# EAGLE design M2 (EAGLE 7.7.0)
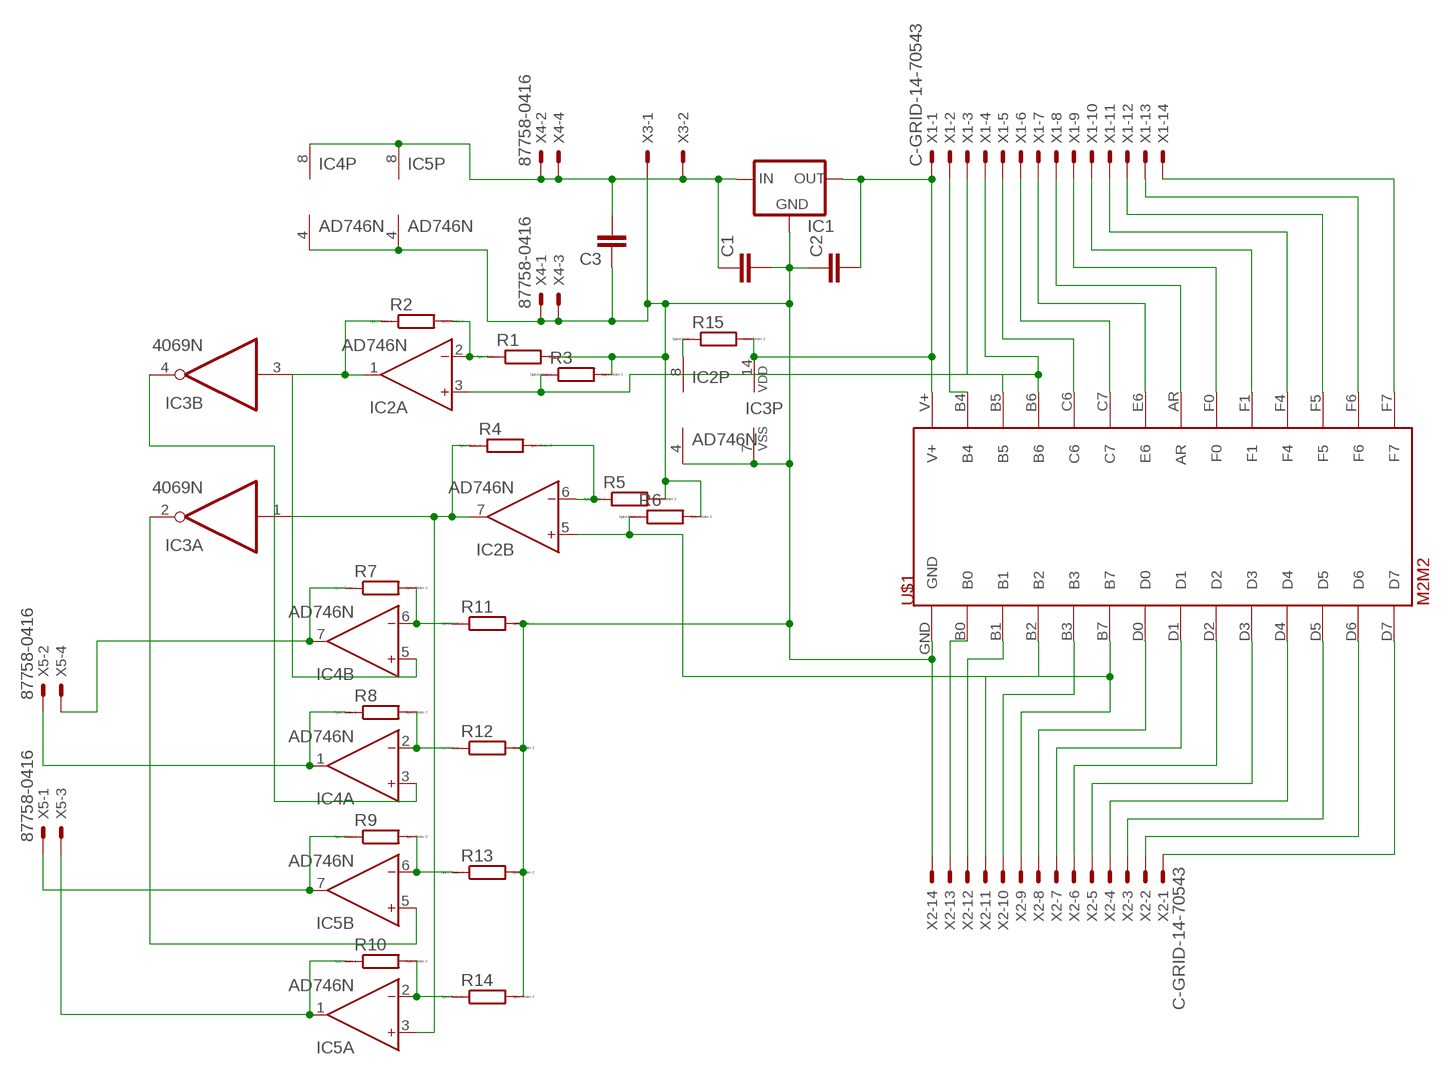
[diagram p0: schematic, sheet 1]

## Parts
C1  C2,5-3  [C2.5-3]
C2  C2,5-3  [C2.5-3]
C3  C2,5-3  [C2.5-3]
IC1  78MXXS  [78MXXS]
IC2  AD746N  [DIL08]
IC3  4069N  [DIL14]
IC4  AD746N  [DIL08]
IC5  AD746N  [DIL08]
R1  R0204/7  [0204/7]
R2  R0204/7  [0204/7]
R3  R0204/7  [0204/7]
R4  R0204/7  [0204/7]
R5  R0204/7  [0204/7]
R6  R0204/7  [0204/7]
R7  R0204/7  [0204/7]
R8  R0204/7  [0204/7]
R9  R0204/7  [0204/7]
R10  R0204/7  [0204/7]
R11  R0204/7  [0204/7]
R12  R0204/7  [0204/7]
R13  R0204/7  [0204/7]
R14  R0204/7  [0204/7]
R15  R0204/7  [0204/7]
U$1  M2M2  [M2]
X1  C-GRID-14-70543  [70543-14]
X2  C-GRID-14-70543  [70543-14]
X3  KK-156-2  [KK-156-2]
X4  87758-0416  [87758-0416]
X5  87758-0416  [87758-0416]

## Nets
N$1: C2.2 IC1.OUT IC3.14(P:VDD) R15.2 U$1.V+ X1.1
N$2: U$1.B4 X1.2
N$3: U$1.B5 X1.3
N$4: IC2.3(A:IN+) R3.1 U$1.B6 X1.4
N$5: U$1.C6 X1.5
N$6: U$1.C7 X1.6
N$7: U$1.E6 X1.7
N$8: U$1.AR X1.8
N$9: U$1.F0 X1.9
N$10: U$1.F1 X1.10
N$11: U$1.F4 X1.11
N$12: U$1.F5 X1.12
N$13: U$1.F6 X1.13
N$14: IC2.8(P:V+) R15.1
N$15: U$1.F7 X1.14
N$16: IC2.1(A:OUT) IC3.3(B:I) IC4.5(B:IN+) R2.1
N$17: U$1.B0 X2.13
N$18: U$1.B1 X2.12
N$19: U$1.B2 X2.11
N$20: U$1.B3 X2.10
N$21: IC2.5(B:IN+) R6.1 U$1.B7 X2.9
N$22: U$1.D0 X2.8
N$23: U$1.D1 X2.7
N$24: U$1.D2 X2.6
N$25: U$1.D3 X2.5
N$26: U$1.D4 X2.4
N$27: U$1.D5 X2.3
N$28: U$1.D6 X2.2
N$29: U$1.D7 X2.1
N$31: IC2.2(A:IN-) R1.1 R2.2
N$32: IC2.6(B:IN-) R4.2 R5.1
N$33: IC2.7(B:OUT) IC3.1(A:I) IC5.3(A:IN+) R4.1
N$34: C1.1 C3.2 IC1.IN IC4.8(P:V+) IC5.8(P:V+) X3.2 X4.2 X4.4
N$35: C1.2 C2.1 C3.1 IC1.GND IC2.4(P:V-) IC3.7(P:VSS) IC4.4(P:V-) IC5.4(P:V-) R1.2 R3.2 R5.2 R6.2 R11.2 R12.2 R13.2 R14.2 U$1.GND X2.14 X3.1 X4.1 X4.3
N$36: IC4.7(B:OUT) R7.1 X5.4
N$37: IC4.1(A:OUT) R8.1 X5.2
N$38: IC5.7(B:OUT) R9.1 X5.1
N$39: IC5.1(A:OUT) R10.1 X5.3
N$40: IC4.6(B:IN-) R7.2 R11.1
N$41: IC4.2(A:IN-) R8.2 R12.1
N$42: IC5.6(B:IN-) R9.2 R13.1
N$43: IC5.2(A:IN-) R10.2 R14.1
N$44: IC3.2(A:O) IC5.5(B:IN+)
N$45: IC3.4(B:O) IC4.3(A:IN+)
Unconnected: IC3.5(C:I) IC3.6(C:O) IC3.8(D:O) IC3.9(D:I) IC3.10(E:O) IC3.11(E:I) IC3.12(F:O) IC3.13(F:I)

## Library data of the parts
C1-C3 = capacitor-wima:C: CAPACITOR naming: grid - package width
IC1 = v-reg:78MXXS: VOLTAGE REGULATOR
IC2 IC4 IC5 = analog-devices:AD746: Dual Precision, 500 ns Settling, BiFET Op Amp Source: http://www.analog.com/static/imported-files/data_sheets/AD746.pdf; MF: ALTERA CORPORATION; MPN: AD746JNZ; OC_FARNELL: 1438363; OC_NEWARK: 59K4844
IC3 = 40xx:4069: Hex INVERTER
R1-R15 = eagle-ltspice:R: RESISTOR, European symbol; SPICEMODEL: NONE; SPICEPREFIX: R
U$1 = m2:M2
X1 X2 = con-molex:C-GRID-14: CONNECTOR wire to board 2.54 mm (0.100") pitch header; OC_FARNELL: unknown; OC_NEWARK: unknown
X3 = con-molex:KK-156-2: KK 156 HEADER Source: http://www.molex.com/pdm_docs/sd/026604100_sd.pdf; OC_FARNELL: unknown; OC_NEWARK: unknown
X4 X5 = con-molex:87758-0416: 4 Pin - 2mm Dual Row Single Wafer, Vertical T/H HDR Source: http://www.molex.com/pdm_docs/sd/877580616_sd.pdf; MF: FARNELL; MPN: 87758-0416; OC_FARNELL: 7472315; OC_NEWARK: 39K3681

## Board
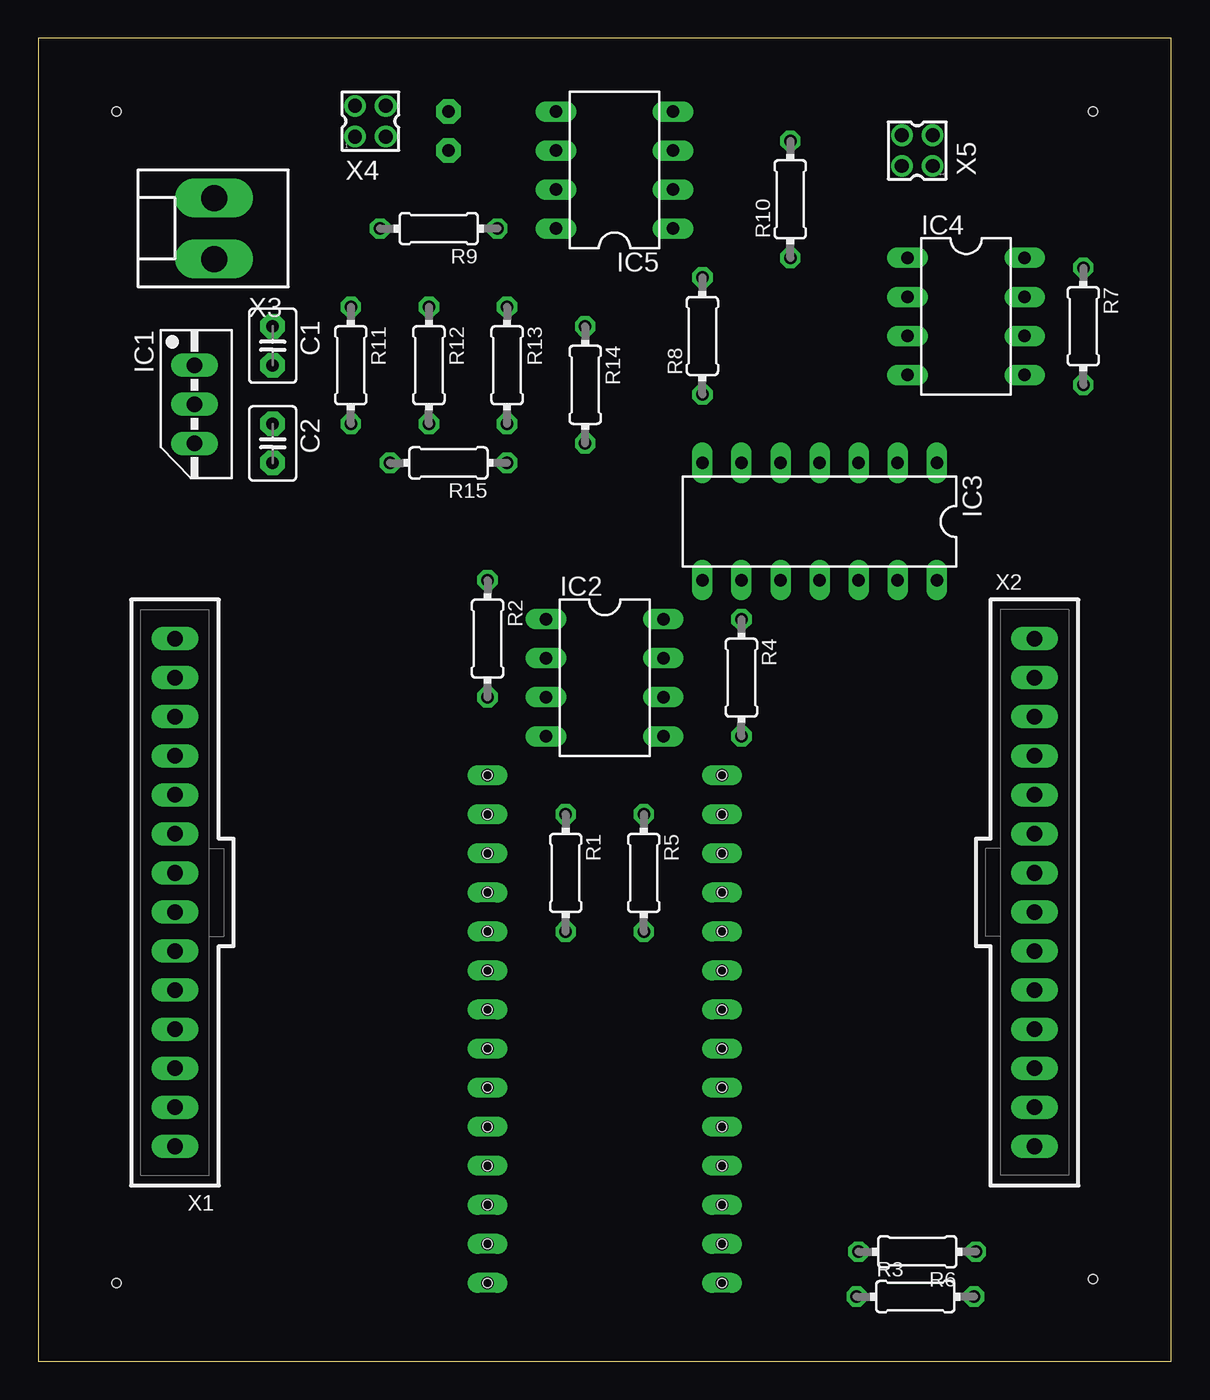
[diagram p1: board, top side]
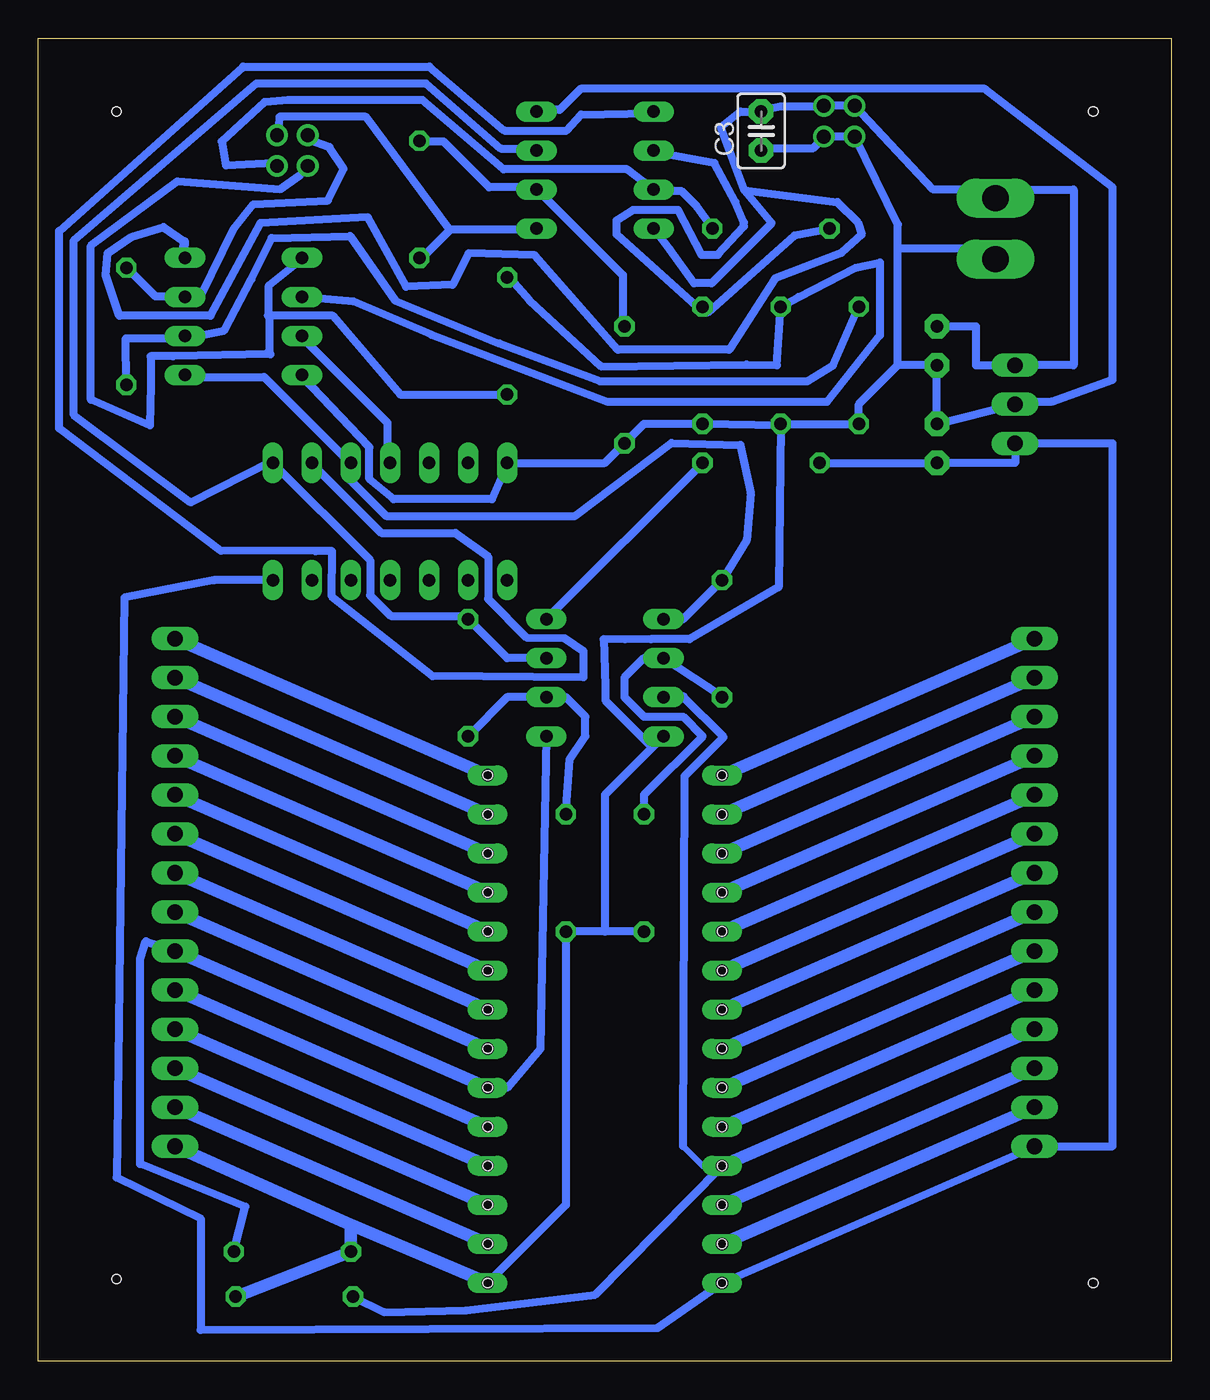
[diagram p2: board, bottom side, seen from below]

Size 73.65 x 86.03 mm. Coordinates in mm from the lower left corner, seen from the top.
Outline: 73.65,0 73.65,86.03 0,86.03 0,0 73.65,0
Copper layers (1*16): Top 0.035mm / dielectric 1.5mm / Bottom 0.035mm
Design rules "default": minimum track width 10mil, minimum drill 24mil, track to track 8mil, track to pad 8mil, pad to pad 8mil, via to via 8mil, smd to smd 8mil, copper to edge 40mil, drill to drill 8mil, minimum pad ring 10mil, minimum via ring 8mil, stop-mask expansion 4mil, vias tented up to drill 0mil, thermal gap 10mil
Holes 0.6 mm at 5.07,5.08 5.07,81.28 68.57,81.28 68.57,5.33

### Footprints (pad centres in the part's own frame; a part is rotated, then mirrored left to right if it is on the bottom)
C2.5-3 = drill 0.813 pad 1.6 octagon: 1 -1.27,0; 2 1.27,0
78MXXS = drill 1.016 long: GND 0,-2.54; IN -2.54,-2.54; OUT 2.54,-2.54
DIL08 = drill 0.813 long: 1 -3.81,-3.81; 2 -1.27,-3.81; 3 1.27,-3.81; 4 3.81,-3.81; 5 3.81,3.81; 6 1.27,3.81; 7 -1.27,3.81; 8 -3.81,3.81
DIL14 = drill 0.813 long: 1 -7.62,-3.81; 2 -5.08,-3.81; 3 -2.54,-3.81; 4 0,-3.81; 5 2.54,-3.81; 6 5.08,-3.81; 7 7.62,-3.81; 8 7.62,3.81; 9 5.08,3.81; 10 2.54,3.81; 11 0,3.81; 12 -2.54,3.81; 13 -5.08,3.81; 14 -7.62,3.81
0204/7 = drill 0.813 octagon: 1 -3.81,0; 2 3.81,0
M2 = drill 0.8 long: AR 1.27,7.62; B0 -13.97,-7.62; B1 -11.43,-7.62; B2 -8.89,-7.62; B3 -6.35,-7.62; B4 -13.97,7.62; B5 -11.43,7.62; B6 -8.89,7.62; B7 -3.81,-7.62; C6 -6.35,7.62; C7 -3.81,7.62; D0 -1.27,-7.62; D1 1.27,-7.62; D2 3.81,-7.62; D3 6.35,-7.62; D4 8.89,-7.62; D5 11.43,-7.62; D6 13.97,-7.62; D7 16.51,-7.62; E6 -1.27,7.62; F0 3.81,7.62; F1 6.35,7.62; F4 8.89,7.62; F5 11.43,7.62; F6 13.97,7.62; F7 16.51,7.62; GND -16.51,-7.62; V+ -16.51,7.62 | hole 0.6: -13.97,7.62; -8.89,7.62; -6.35,7.62; 6.35,7.62; 8.89,7.62; 11.43,7.62; 13.97,7.62; 16.51,7.62; 16.51,-7.62; 13.97,-7.62; 11.43,-7.62; 8.89,-7.62; 6.35,-7.62; 3.81,-7.62; 1.27,-7.62; -1.27,-7.62; -3.81,-7.62; -6.35,-7.62; -8.89,-7.62; -11.43,-7.62; -13.97,-7.62; -16.51,-7.62; -16.51,7.62; -11.43,7.62; -3.81,7.62; -1.27,7.62; 1.27,7.62; 3.81,7.62
70543-14 = drill 1.016 long: 1 -16.51,0; 2 -13.97,0; 3 -11.43,0; 4 -8.89,0; 5 -6.35,0; 6 -3.81,0; 7 -1.27,0; 8 1.27,0; 9 3.81,0; 10 6.35,0; 11 8.89,0; 12 11.43,0; 13 13.97,0; 14 16.51,0
KK-156-2 = drill 1.7 pad 2.184 long: 1 -1.98,0; 2 1.98,0
87758-0416 = drill 0.9 pad 1.27: 1 -1,-1; 2 -1,1; 3 1,-1; 4 1,1

### Placement (x,y rotation side)
C1  15.23,66.04 270 top
C2  15.23,59.69 270 top
C3  26.66,80.01 90 bottom
IC1  12.69,62.23 270 top
IC2  36.82,44.45 270 top
IC3  50.79,54.61 180 top
IC4  60.32,67.94 270 top
IC5  37.46,77.47 90 top
R1  34.28,31.75 270 top
R2  29.2,46.99 270 top
R3  57.01,4.19 0 top
R4  45.71,44.45 270 top
R5  39.36,31.75 270 top
R6  57.14,7.11 180 top
R7  67.93,67.31 270 top
R8  43.17,66.67 90 top
R9  26.02,73.66 180 top
R10  48.89,75.56 90 top
R11  20.31,64.77 270 top
R12  25.39,64.77 270 top
R13  30.47,64.77 270 top
R14  35.55,63.5 270 top
R15  26.66,58.42 180 top
U$1  36.82,21.59 90 top
X1  8.88,30.48 90 top
X2  64.76,30.48 270 top
X3  11.42,73.66 90 top
X4  21.58,80.64 0 top
X5  57.14,78.74 90 top

### Tracks (layer width: path | path; a pad name or v marks a point on that pad's centre or on a via)
N$1
  Bottom 0.508: IC3.14 62.22,50.8 68.06,49.66 68.57,11.94 63.11,9.27 63.11,2.03 33.39,2.16 U$1.V+ X1.1 3.8,13.97 3.8,59.69 IC1.OUT 10.15,58.42 C2.2 R15.2
N$2
  Bottom 0.813: U$1.B4 X1.2
N$3
  Bottom 0.813: U$1.B5 X1.3
N$4
  Bottom 0.254: U$1.B6 30.47,12.7
  Bottom 0.406: 30.47,12.7 31.74,13.97
  Bottom 0.508: R3.1 51.17,3.17 45.84,3.3 37.46,4.32 U$1.B6 | 31.74,13.97 31.64,38.05 29.1,40.59 31.74,43.18
  Bottom 0.61: 31.74,43.18 IC2.3
  Bottom 0.813: U$1.B6 X1.4
N$5
  Bottom 0.813: U$1.C6 X1.5
N$6
  Bottom 0.813: U$1.C7 X1.6
N$7
  Bottom 0.813: U$1.E6 X1.7
N$8
  Bottom 0.813: U$1.AR X1.8
N$9
  Bottom 0.813: U$1.F0 X1.9
N$10
  Bottom 0.813: U$1.F1 X1.10
N$11
  Bottom 0.813: U$1.F4 X1.11
N$12
  Bottom 0.813: U$1.F5 X1.12
N$13
  Bottom 0.813: X1.13 U$1.F6
N$14
  Bottom 0.508: IC2.8 R15.1
N$15
  Bottom 0.813: U$1.F7 X1.14
N$16
  Bottom 0.406: 53.48,58.52 IC3.3 | 64,64.01 IC4.5
  Bottom 0.508: IC2.1 31.74,48.26 R2.1 27.6,53.39 27.35,56.46 28.01,59.59 32.48,59.72 38.75,54.97 51.04,54.97 53.36,57.28 IC3.3 | 53.48,58.52 58.97,64.01 64,64.01
N$17
  Bottom 0.813: U$1.B0 X2.13
N$18
  Bottom 0.813: U$1.B1 X2.12
N$19
  Bottom 0.813: U$1.B2 X2.11
N$20
  Bottom 0.813: U$1.B3 X2.10
N$21
  Bottom 0.406: 43.17,17.78 U$1.B7
  Bottom 0.508: R6.1 60.19,10.03 67.05,12.83 67.05,26.16 66.66,27.3 X2.9 | IC2.5 41.01,20.32 43.17,17.78
  Bottom 0.813: U$1.B7 X2.9
N$22
  Bottom 0.813: U$1.D0 X2.8
N$23
  Bottom 0.813: U$1.D1 X2.7
N$24
  Bottom 0.813: U$1.D2 X2.6
N$25
  Bottom 0.813: U$1.D3 X2.5
N$26
  Bottom 0.813: U$1.D4 X2.4
N$27
  Bottom 0.813: U$1.D5 X2.3
N$28
  Bottom 0.813: U$1.D6 X2.2
N$29
  Bottom 0.813: U$1.D7 X2.1
N$31
  Bottom 0.508: R2.2 30.09,43.81 IC2.2 34.28,45.72 35.55,44.45 35.55,43.18 34.28,41.91 31.74,41.91 30.47,40.64 34.28,36.83 R1.1
N$32
  Bottom 0.508: R5.1 39.11,39.12 38.09,40.64 38.09,41.91 39.36,43.18 IC2.6 43.17,43.18 R4.2
N$33
  Bottom 0.254: 58.51,58.52 IC3.1 | 45.71,48.46 R4.1
  Bottom 0.508: IC2.7 43.17,45.72 R4.1 | 58.51,58.52 63.74,55.85 71.34,61.54 71.34,72.9 59.48,83.11 48.45,83.11 43.58,78.87 41.37,78.87 IC5.3 | 45.71,48.46 50.74,48.46 52.09,49.81 52.09,52.09 IC3.1
N$34
  Bottom 0.254: 33.59,73.61 IC5.8 | 64.23,71.78 IC4.8 | 22.62,81.61 X4.4
  Bottom 0.508: X4.4 X4.2 15.47,76.2 11.42,76.2 6.34,76.2 6.34,64.77 IC1.IN 12.69,64.77 12.69,67.31 C1.1 | 33.59,73.61 32.63,72.34 31.03,70.1 29.89,70.1 25.97,74.02 27.75,76.15 | 27.75,76.15 29.28,80.26 28.01,81.28 C3.2 26.51,81.38 25.39,81.61 22.62,81.61 | 64.18,72.8 65.52,73.76 67.58,73.13 69.15,72.06 69.28,70.64 68.39,68 62.47,68 59.22,74.02 52.24,74.4 49.75,69.88 46.73,70 45.69,72.06 41.37,71.93 35.98,65.79 28.74,65.79 25.75,70.43 21.43,72.08 20.13,73.25 20.39,74.07 21.71,75.39 27.75,76.15
  Bottom 0.61: X3.2 11.42,76.2 | 64.18,72.8 64.23,71.78
N$35
  Bottom 0.254: 53.33,8.67 53.64,8.99 | R12.2 25.39,60.83 | 26.51,78.87 C3.1 | 22.62,79.55 X4.3
  Bottom 0.406: 56.45,64.01 IC4.4
  Bottom 0.508: 17.77,72.39 17.77,73.93 X4.1 X4.3 | 17.77,64.77 C1.2 C2.1 IC1.GND 10.05,62.41 7.76,62.41 3.8,63.83 3.8,76.35 12.11,82.75 38.4,82.75 39.77,81.38 41.14,81.38 IC5.4 | 17.77,64.77 17.77,72.39 | 17.77,72.39 11.42,72.39 X3.1 | R1.2 36.82,27.94 | 36.82,27.94 R5.2 39.36,10.16 U$1.GND | 36.82,27.94 36.82,36.83 IC2.4 33.82,40.01 36.8,42.98 36.8,43.89 36.9,46.97 35.5,46.94 33.82,46.97 31.31,46.97 25.52,50.34 25.39,60.83 R13.2 34.28,60.96 R14.2 36.82,58.42 IC3.7 43.2,58.29 44.16,56.06 50.56,56.06 52.14,57.38 52.14,59.44 56.45,64.01 | R12.2 R11.2 20.31,62.23 17.77,64.77 | 26.51,78.87 23.31,78.87 22.62,79.55
  Bottom 0.813: U$1.GND 53.64,8.99 X2.14 | R3.2 R6.2 53.33,8.67
N$36
  Bottom 0.254: 64.23,69.27 IC4.7 64,69.27 | 67.88,71.09 R7.1
  Bottom 0.508: 64.23,69.27 66.05,69.27 67.88,71.09 | 64,69.27 63.08,69.27 60.95,73.66 59.68,75.23 54.83,75.49 53.81,77.55 54.73,78.97 56,79.43 X5.4
N$37
  Bottom 0.406: 56.68,71.55 IC4.1 | 56.68,77.09 56.23,77.72
  Bottom 0.508: R8.1 50.13,62.87 54.5,68 58.64,68 | 56.68,71.55 58.66,69.95 58.66,68.02 58.74,68.02 58.74,68 58.64,68 | 56.68,77.09 57.93,76.22 64.61,76.73 70.25,72.54 70.25,62.53 66.41,60.86 66.33,63.5 66.36,65.35 64.91,65.35 58.56,65.48 58.69,65.66 58.64,65.66 58.64,68
  Bottom 0.61: 56.23,77.72 X5.2
N$38
  Bottom 0.406: 33.82,76.35 IC5.7
  Bottom 0.508: 29.94,73.84 30.85,75.11 31.87,76.12 33.59,76.12 | 33.82,76.35 35.37,77.52 43.42,77.52 48.68,82.02 57.42,82.02 58.94,81.89 61.74,79.32 61.46,77.78 58.28,77.95 X5.1
  Bottom 0.61: 29.94,73.84 R9.1 | 33.59,76.12 IC5.7
N$39
  Bottom 0.254: 41.37,73.61 IC5.1
  Bottom 0.406: 46.9,73.56 46.85,73.61 | 48.68,71.78 R10.1
  Bottom 0.508: 46.85,73.61 41.37,73.61 | 48.68,71.78 46.9,73.56 52.37,80.92 57.98,80.92 58.05,79.78
  Bottom 0.61: 58.05,79.78 X5.3
N$40
  Bottom 0.406: 64,66.52 IC4.6
  Bottom 0.508: R7.2 67.96,66.52 64.23,66.52 IC4.6 | R11.1 21.99,64.77 23.66,63.73 37.15,63.73 43.68,66.19 50.46,68.99 53.38,73.18 58.49,73.05 59.81,70.36 61.59,67.03 64,66.52
N$41
  Bottom 0.254: 25.36,68.58 R12.1
  Bottom 0.508: R12.1 25.64,64.77 27.62,64.82 37.05,64.69 41.75,69.01 42.97,70.41 R8.2 | 25.36,68.58 24.22,69.22 20.51,71.12 18.94,71.45 18.94,66.73 22.39,62.38 36.62,62.38 48.1,66.75 53.15,68.91 IC4.2
N$42
  Bottom 0.406: 33.59,78.64 IC5.6
  Bottom 0.508: R9.2 22.39,73.61 24.48,73.23 30.14,68.2 R13.1 30.85,68.58 36.06,73.28 36.06,74.19 34.99,74.88 32.07,74.88 30.55,71.96 29.48,71.96 27.78,73.79 27.78,74.07 28.34,75.39 29.71,77.93 33.59,78.64
N$43
  Bottom 0.254: 41.14,76.12 IC5.2
  Bottom 0.406: 48.68,79.32 R10.2 | 41.37,76.35 IC5.2
  Bottom 0.508: 41.14,76.12 35.65,70.64 35.65,67.44 R14.1 | 48.68,79.32 47.31,79.32 44.34,76.35 41.37,76.35
N$44
  Bottom 0.406: 33.82,81.15 IC5.5 | 55.77,58.29 IC3.2
  Bottom 0.508: 33.82,81.15 38.37,81.08 39.31,80.03 43.35,80.03 48.23,84.2 60.34,84.2 72.3,73.51 72.3,60.68 61.79,52.7 55.64,52.68 54.55,52.68 54.58,49.73 48.02,44.55 38.22,44.48 38.22,46.18 39.46,47.02 41.93,47.07 44.41,49.58 44.41,52.32 46.55,53.87 51.35,53.87 55.77,58.29
N$45
  Bottom 0.254: 50.97,58.52 IC3.4 | 56.45,66.52 IC4.3
  Bottom 0.508: 50.97,58.52 50.97,61.04 56.45,66.52